# Altium schematic sheet Finale_Competition.SchDoc
size A; SheetNumber: 1; SheetTotal: 1
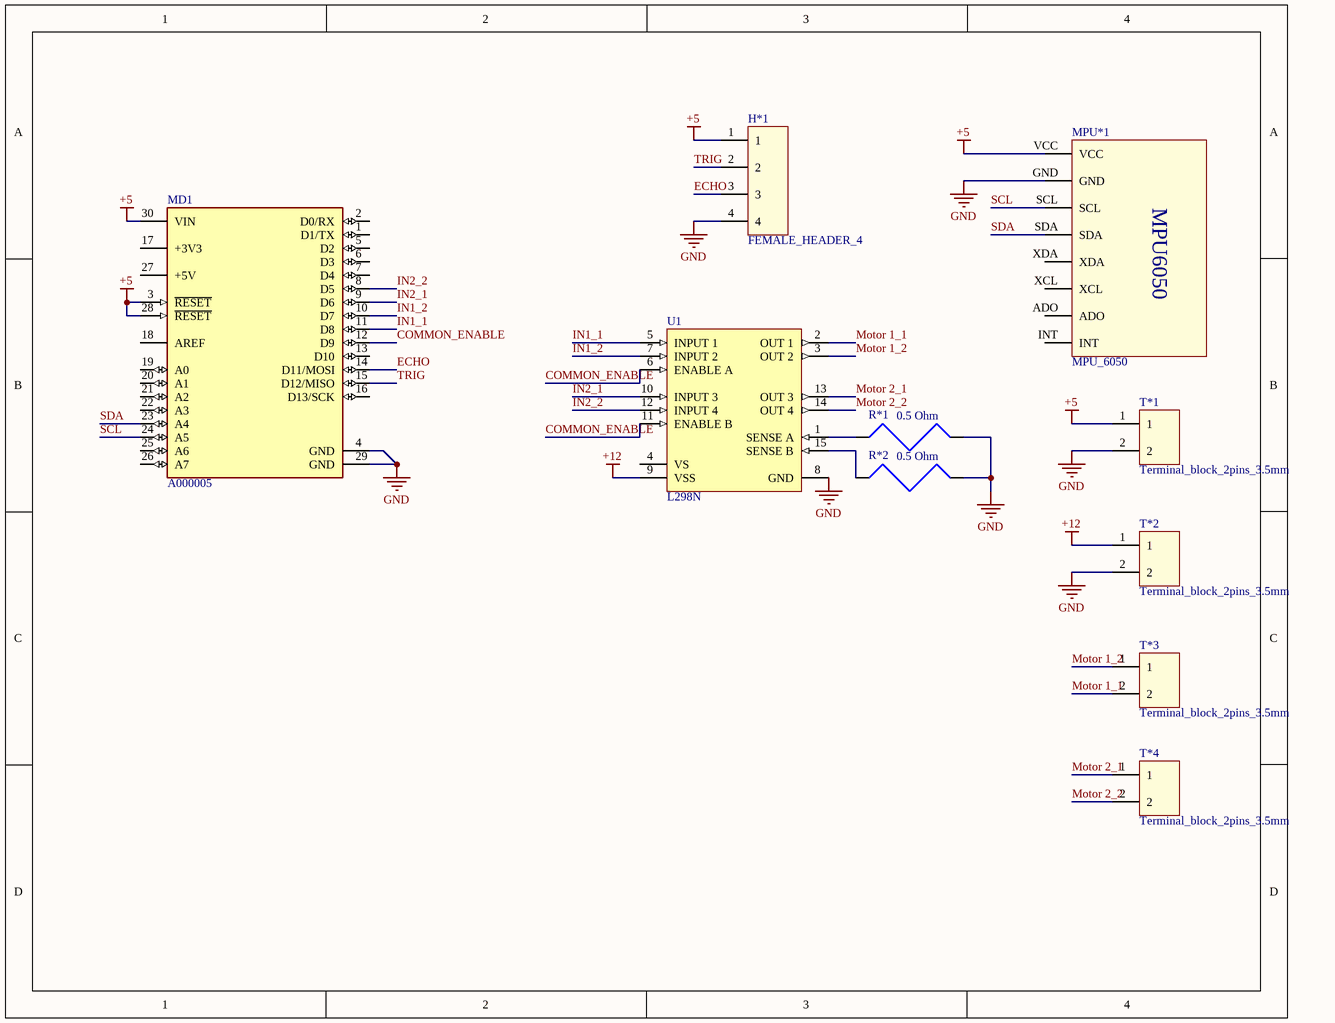
[diagram p0: Finale_Competition.SchDoc]

## Parts
H*1  FEMALE_HEADER_4  [Female_Header_4]
MD1  A000005  [FP-A000005-MFG]
MPU*1  MPU_6050  [MPU6050]
R*1  0.5 Ohm  [Resistor]
R*2  0.5 Ohm  [Resistor]
T*1  Terminal_block_2pins_3.5mm  [Terminal_block_2pins_3.5mm]
T*2  Terminal_block_2pins_3.5mm  [Terminal_block_2pins_3.5mm]
T*3  Terminal_block_2pins_3.5mm  [Terminal_block_2pins_3.5mm]
T*4  Terminal_block_2pins_3.5mm  [Terminal_block_2pins_3.5mm]
U1  L298N  [STM-FM-15]

## Nets
+5: H*1.1 MD1.3(~{RESET}) MD1.28(~{RESET}) MD1.30(VIN) MPU*1.VCC T*1.1
+12: T*2.1 U1.9(VSS)
GND: H*1.4 MD1.4(GND) MD1.29(GND) MPU*1.GND R*1.2 R*2.2 T*1.2 T*2.2 U1.8(GND)
COMMON_ENABLE: MD1.12(D9) U1.6(ENABLE_A) U1.11(ENABLE_B)
ECHO: H*1.3 MD1.14(D11/MOSI)
IN1_1: MD1.11(D8) U1.5(INPUT_1)
IN1_2: MD1.10(D7) U1.7(INPUT_2)
IN2_1: MD1.9(D6) U1.10(INPUT_3)
IN2_2: MD1.8(D5) U1.12(INPUT_4)
Motor 1_1: T*3.2 U1.2(OUT_1)
Motor 1_2: T*3.1 U1.3(OUT_2)
Motor 2_1: T*4.1 U1.13(OUT_3)
Motor 2_2: T*4.2 U1.14(OUT_4)
SCL: MD1.24(A5) MPU*1.SCL
SDA: MD1.23(A4) MPU*1.SDA
TRIG: H*1.2 MD1.15(D12/MISO)
NetR*1_1: R*1.1 U1.1(SENSE_A)
NetR*2_1: R*2.1 U1.15(SENSE_B)

Not connected (* = marked no-connect by the designer): MD1 1(D1/TX) 2(D0/RX) 5(D2) 6(D3) 7(D4) 13(D10) 16(D13/SCK) 17(+3V3) 18(AREF) 19(A0) 20(A1) 21(A2) 22(A3) 25(A6) 26(A7) 27(+5V); MPU*1 ADO INT XCL XDA; U1 4(VS)

## Notes on the sheet
- (in symbol MPU_6050) MPU6050

## Library data of the parts
MD1 = CMP-189986-000002-1: ARDUINO NANO ATMEGA328 EVAL BRD; Number of Bits: 8; Evaluation Kit: Yes; Operating Supply Voltage: 12V; Interface: I2C; Data Bus Width: 8b; Core Architecture: AVR; Packaging: Bulk; Length: 7inch; Package Quantity: 50; Width: 5inch; REACH SVHC: No SVHC; Weight: 0.358383oz; Series: AVR® ATmega; Height: 0.25inch
R*1 R*2 = Resistor
U1 = CMP-2000-06526-1: Dual Full-Bridge Driver, 4.8 to 46 V, -40 to 150 degC, 15-Pin FM (MW 15L), RoHS, Tube; Manufacturer: STMicroelectronics; PartNumber: L298; Output Current: 2A; Supply Voltage Max: 7V; Driver Case Style: Multiwatt; Supply Voltage Min: 4.5V; No. of Pins: 15Pins; SVHC: NoSVHC(17-Dec-2015); Output Voltage: 46V; No. of Outputs: 4Outputs; Motor Type: FullBridge; MSL: -; Package Description: 15-Pin Flange Mount, Body 5 x 19.6 mm, Pitch 1.27 mm; Datasheet Version: 01/2000; Package Reference: FM-15; Mounting Technology: ThroughHole; Packaging: Each; Automotive Qualification Standard: -; Product Range: -; Datasheet URL: https://datasheet.ciiva.com/15109/getdatasheetpartid-50682-15109332.pdf; Operating Temperature Max: 130°C; Operating Temperature Min: -25°C; Manufacturer URL: http://www.st.com/